# Altium schematic sheet Serial.SchDoc: Serial
size A3; Author: Orhun DABAK; DrawnBy: Orhun DABAK; Revision: 1.0; SheetNumber: 3; SheetTotal: 3
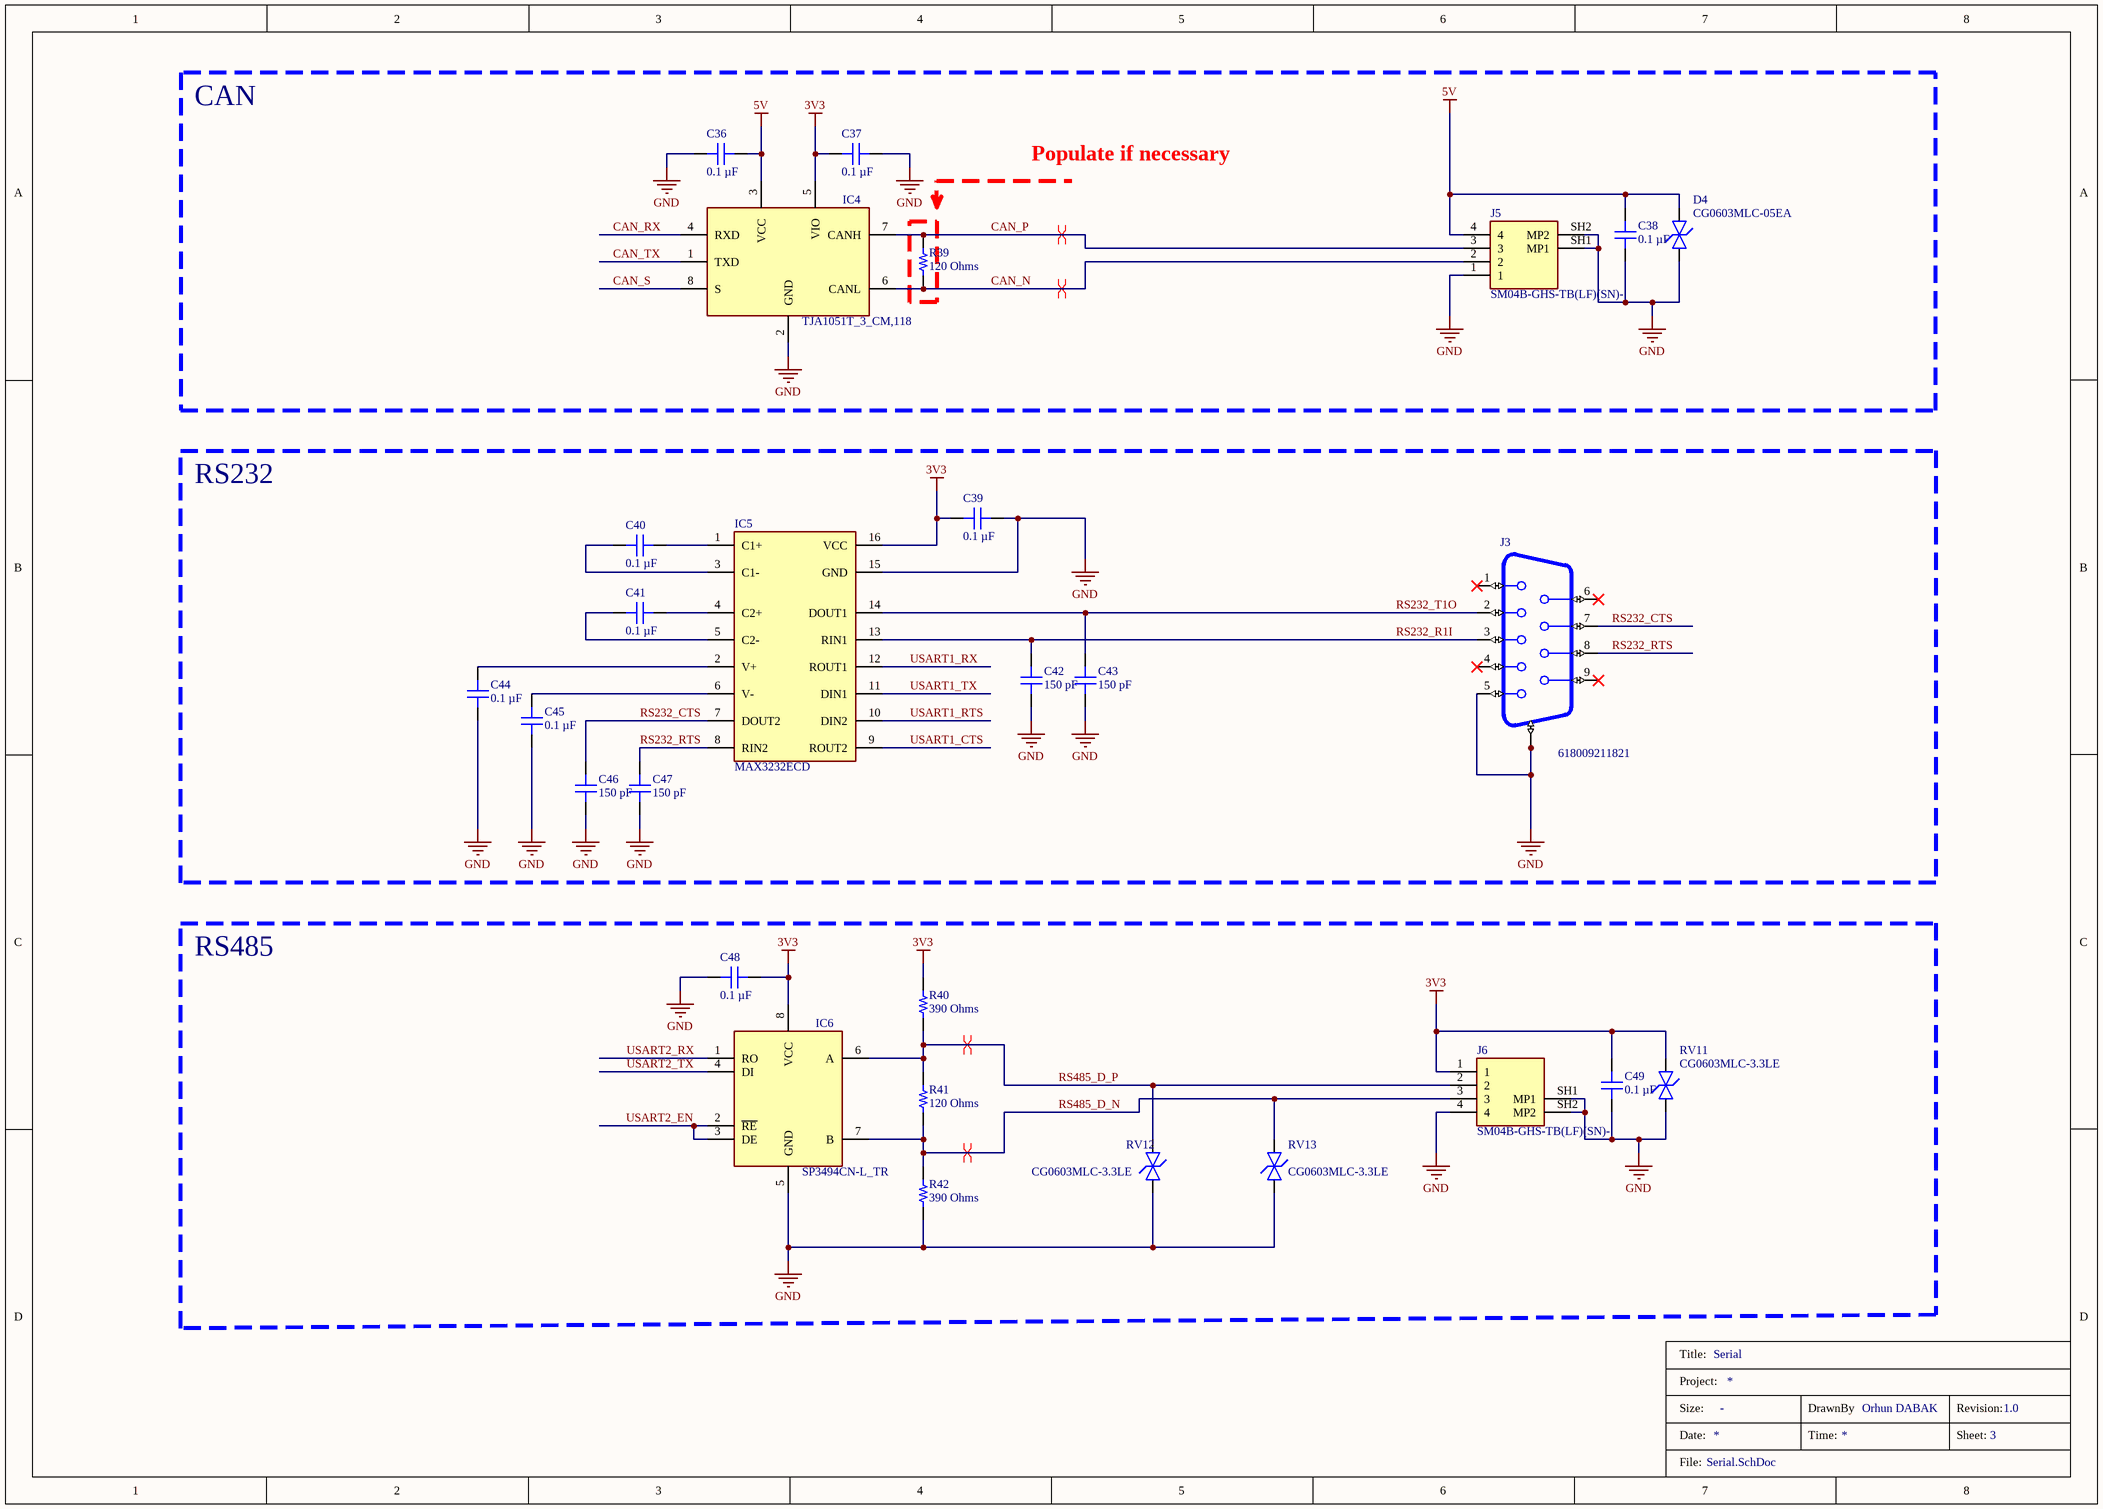
[diagram p0: Serial.SchDoc]

## Parts
*  Title_Block  (value not drawn)  (graphical)
C36  0.1 µF  [CAP 0603_1608]
C37  0.1 µF  [CAP 0603_1608]
C38  0.1 µF  [CAP 0603_1608]
C39  0.1 µF  [CAP 0603_1608]
C40  0.1 µF  [CAP 0603_1608]
C41  0.1 µF  [CAP 0603_1608]
C42  150 pF  [CAP 0603_1608]
C43  150 pF  [CAP 0603_1608]
C44  0.1 µF  [CAP 0603_1608]
C45  0.1 µF  [CAP 0603_1608]
C46  150 pF  [CAP 0603_1608]
C47  150 pF  [CAP 0603_1608]
C48  0.1 µF  [CAP 0603_1608]
C49  0.1 µF  [CAP 0603_1608]
D4  CG0603MLC-05EA  [DIONC1608X55N]
IC4  TJA1051T_3_CM,118  [SOIC127P600X175-8N]
IC5  MAX3232ECD  [SOIC127P600X175-16N]
IC6  SP3494CN-L_TR  [SOIC127P600X175-8N]
J3  618009211821  [618009211821]
J5  SM04B-GHS-TB(LF)(SN)-  [JST_SM04B-GHS-TB(LF)(SN)-]
J6  SM04B-GHS-TB(LF)(SN)-  [JST_SM04B-GHS-TB(LF)(SN)-]
R39  120 Ohms  [RES 0603_1608]
R40  390 Ohms  [RES 0603_1608]
R41  120 Ohms  [RES 0603_1608]
R42  390 Ohms  [RES 0603_1608]
RV11  CG0603MLC-3.3LE  [VARC1608X55N]
RV12  CG0603MLC-3.3LE  [VARC1608X55N]
RV13  CG0603MLC-3.3LE  [VARC1608X55N]

## Blocks framed on the sheet
CAN: C36-C38 D4 IC4 J5 R39
RS232: C39-C47 IC5 J3
RS485: C48 C49 IC6 J6 R40-R42 RV11-RV13

## Nets
3V3: C37.2 C39.2 C48.1 C49.2 IC4.5(VIO) IC5.16(VCC) IC6.8(VCC) J6.1 R40.2 RV11.2
5V: C36.1 C38.2 D4.2 IC4.3(VCC) J5.4
GND: C36.2 C37.1 C38.1 C39.1 C42.1 C43.1 C44.1 C45.1 C46.1 C47.1 C48.2 C49.1 D4.1 IC4.2(GND) IC5.15(GND) IC6.5(GND) J3.5 J3.Z1(SHIELD) J3.Z2(SHIELD) J5.1 J5.SH1(MP1) J5.SH2(MP2) J6.4 J6.SH1(MP1) J6.SH2(MP2) R42.1 RV11.1 RV12.1 RV13.1
CAN_N: IC4.6(CANL) J5.2 R39.1
CAN_P: IC4.7(CANH) J5.3 R39.2
CAN_RX: IC4.4(RXD)
CAN_S: IC4.8(S)
CAN_TX: IC4.1(TXD)
RS232_CTS: C46.2 IC5.7(DOUT2) J3.7
RS232_R1I: C42.2 IC5.13(RIN1) J3.3
RS232_RTS: C47.2 IC5.8(RIN2) J3.8
RS232_T1O: C43.2 IC5.14(DOUT1) J3.2
RS485_D_N: IC6.7(B) J6.3 R41.1 R42.2 RV13.2
RS485_D_P: IC6.6(A) J6.2 R40.1 R41.2 RV12.2
USART1_CTS: IC5.9(ROUT2)
USART1_RTS: IC5.10(DIN2)
USART1_RX: IC5.12(ROUT1)
USART1_TX: IC5.11(DIN1)
USART2_EN: IC6.2(~{RE}) IC6.3(DE)
USART2_RX: IC6.1(RO)
USART2_TX: IC6.4(DI)
NetC40_1: C40.1 IC5.1(C1+)
NetC40_2: C40.2 IC5.3(C1-)
NetC41_1: C41.1 IC5.4(C2+)
NetC41_2: C41.2 IC5.5(C2-)
NetC44_2: C44.2 IC5.2(V+)
NetC45_2: C45.2 IC5.6(V-)

Not connected (* = marked no-connect by the designer): J3 1* 4* 6* 9*

## Layout directives
differential pair: CAN_N, CAN_P, RS485_D_N, RS485_D_P

## Notes on the sheet
- Populate if necessary
- (in symbol Title_Block) Title:; Project:; Size:; DrawnBy; Revision:; Date:; Time:; Sheet:; File:

## Library data of the parts
* = Title_Block: Standart Title Block; Size: -
C36-C41 C44 C45 C48 C49 = CS0603KRX7R7BB104: CAP CER 0.1UF 16V X7R 0603; manufacturer: Yageo; Tolerance: ±10%; Part Number: CS0603KRX7R7BB104; Value: 0.1 µF; Applications: Boardflex Sensitive; Capacitance: 0.1 µF; componentlink1description: Datasheet; componentlink1url: http://www.yageo.com/NewPortal/yageodocoutput?fileName=/pdf/MLCC/UPY-ST_NPOX7R_16V-to-3KV_5.pdf; componentlink2description: DigiKey Link; componentlink2url: https://www.digikey.com/en/products/detail/yageo/CS0603KRX7R7BB104/6097897; Device Package: 0603 (1608 Metric); Features: Soft Termination; lastupdated: 3/3/2023 08:08:52 PM; Lifecycle Status: Active; Minimum Order: 1; Mounting Type: Surface Mount, MLCC; Operating Temperature: -55°C ~ 125°C; Package / Case: 0603 (1608 Metric); packaging: TapeAndReel; partid: 2286; Part Status: Active; price: 0.01; series: CS; Size / Dimension: 0.063" L x 0.031" W (1.60mm x 0.80mm); Supplier 1: DigiKey; Supplier Part Number 1: 311-3560-1-ND; Temperature Coefficient: X7R; Thickness (Max): 0.037" (0.95mm); Voltage - Rated: 16V
C42 C43 C46 C47 = 885012206029: CAP CER 150PF 16V X7R 0603; manufacturer: Würth Elektronik; Tolerance: ±10%; Part Number: 885012206029; Value: 150 pF; Applications: General Purpose; Capacitance: 150 pF; componentlink1description: Datasheet; componentlink1url: https://katalog.we-online.de/pbs/datasheet/885012206029.pdf; componentlink2description: DigiKey Link; componentlink2url: https://www.digikey.com/en/products/detail/würth-elektronik/885012206029/5453803; Device Package: 0603 (1608 Metric); lastupdated: 3/3/2023 08:08:49 PM; Lifecycle Status: Active; Minimum Order: 1; Mounting Type: Surface Mount, MLCC; Operating Temperature: -55°C ~ 125°C; Package / Case: 0603 (1608 Metric); packaging: TapeAndReel; partid: 3529; Part Status: Active; price: 0.02; series: WCAP-CSGP; Size / Dimension: 0.063" L x 0.031" W (1.60mm x 0.80mm); Supplier 1: DigiKey; Supplier Part Number 1: 732-7948-1-ND; Temperature Coefficient: X7R; Thickness (Max): 0.034" (0.87mm); Voltage - Rated: 16V
D4 = CG0603MLC-05EA: TVS Diode (Bi-directional); Manufacturer_Name: Bourns; Datasheet Link: https://datasheet.datasheetarchive.com/originals/dk/DKDS-12/224862.pdf; Height: 0.55mm; Manufacturer_Part_Number: CG0603MLC-05EA
IC4 = TJA1051T_3_CM,118: Integrated Circuit; Manufacturer_Name: NXP; Manufacturer_Part_Number: TJA1051T/3/CM,118; Datasheet Link: http://www.nxp.com/docs/en/data-sheet/TJA1051.pdf; Height: 1.75mm; Mouser Part Number: 771-TJA1051T/3CM118; Mouser Price/Stock: https://www.mouser.co.uk/ProductDetail/NXP-Semiconductors/TJA1051T-3-CM118?qs=5XOdhvmYM0NUkmo%252BpXvJfw%3D%3D; Arrow Part Number: TJA1051T/3/CM,118; Arrow Price/Stock: https://www.arrow.com/en/products/tja1051t3cm118/nxp-semiconductors?region=nac
IC5 = MAX3232ECD: Integrated Circuit; Manufacturer_Name: Texas Instruments; Datasheet Link: http://www.ti.com/lit/gpn/max3232e; Height: 1.75mm; Manufacturer_Part_Number: MAX3232ECD; Mouser Part Number: 595-MAX3232ECD; Mouser Price/Stock: https://www.mouser.co.uk/ProductDetail/Texas-Instruments/MAX3232ECD?qs=paYhMW8qfisAgX9h7jy%2FVw%3D%3D; Arrow Part Number: MAX3232ECD; Arrow Price/Stock: https://www.arrow.com/en/products/max3232ecd/texas-instruments?region=nac
IC6 = SP3494CN-L_TR: Integrated Circuit; Manufacturer_Name: MaxLinear; Manufacturer_Part_Number: SP3494CN-L/TR; Datasheet Link: https://www.arrow.com/en/products/sp3494cn-ltr/maxlinear-inc?region=nac; Height: 1.75mm; Mouser Part Number: 701-SP3494CN-L/TR; Mouser Price/Stock: https://www.mouser.co.uk/ProductDetail/MaxLinear/SP3494CN-L-TR?qs=3EMgrMjM0faUFCPV%252BPTaUQ%3D%3D; Arrow Part Number: SP3494CN-L/TR; Arrow Price/Stock: https://www.arrow.com/en/products/sp3494cn-ltr/maxlinear-inc?region=nac
J3 = 618009211821: 9 Position D-Sub Receptacle, Female Sockets Connector; MF: WÃ¼rth Elektronik; Value: *; Availability: In Stock; SnapEDA_Link: https://www.snapeda.com/parts/618009211821/Wurth+Elektronik/view-part/?ref=snap; Check_prices: https://www.snapeda.com/parts/618009211821/Wurth+Elektronik/view-part/?ref=eda; Package: None; Purchase-URL: https://pricing.snapeda.com/search/part/618009211821/?ref=eda; MP: 618009211821; Price: None
J5 J6 = SM04B-GHS-TB(LF)(SN)-: Connector Header Surface Mount, Right Angle 4 position 0.049 _1.25mm_; MP: SM04B-GHS-TB_LF__SN_-; MF: JST Sales; Availability: Unavailable; Package: None; Value: *; Price: None; SnapEDA_Link: https://www.snapeda.com/parts/SM04B-GHS-TB%28LF%29%28SN%29-/JST%20Sales%20America%20Inc./view-part/2759740/?ref=snap
R39 R41 = CRCW0603120RJNEA: RES SMD 120 OHM 5% 1/10W 0603; Manufacturer: Vishay Dale; Power (Watts): 0.1W, 1/10W; Temperature Coefficient: ±200ppm/°C; Part Number: CRCW0603120RJNEA; Value: 120 Ohms; ComponentLink1Description: Datasheet; ComponentLink1URL: http://www.vishay.com/docs/20035/dcrcwe3.pdf; ComponentLink2Description: DigiKey Link; ComponentLink2URL: https://www.digikey.com/en/products/detail/vishay-dale/CRCW0603120RJNEA/1174207; Composition: Thick Film; Device Package: 0603 (1608 Metric); Features: Automotive AEC-Q200; Height - Seated (Max): 0.020" (0.50mm); LastUpdated: 3/3/2023 08:29:48 PM; Lifecycle Status: Active; Minimum Order: 1; Number of Terminations: 2; Operating Temperature: -55°C ~ 155°C; Package / Case: 0603 (1608 Metric); Packaging: CutTape; PartId: 5196; Part Status: Active; Price: 0.01; Ratings: AEC-Q200; Resistance: 120 Ohms; Series: CRCW; Size / Dimension: 0.063" L x 0.033" W (1.60mm x 0.85mm); Supplier 1: DigiKey; Supplier Part Number 1: 541-120GCT-ND; Supplier Device Package: 0603; Tolerance: ±5%
R40 R42 = CRGP0603F390R: RES 390 OHM 1% 1/4W 0603; Manufacturer: TE Connectivity Passive Product; Power (Watts): 0.25W, 1/4W; Temperature Coefficient: ±100ppm/°C; Part Number: CRGP0603F390R; Value: 390 Ohms; ComponentLink1Description: Datasheet; ComponentLink1URL: https://www.te.com/commerce/DocumentDelivery/DDEController?Action=srchrtrv&DocNm=9-1773463-9&DocType=DS&DocLang=English; ComponentLink2Description: DigiKey Link; ComponentLink2URL: https://www.digikey.com/en/products/detail/te-connectivity-passive-product/CRGP0603F390R/8577013; Composition: Thick Film; Device Package: 0603 (1608 Metric); Features: Pulse Withstanding; Height - Seated (Max): 0.022" (0.55mm); LastUpdated: 3/3/2023 08:29:49 PM; Lifecycle Status: Active; Minimum Order: 1; Number of Terminations: 2; Operating Temperature: -55°C ~ 155°C; Package / Case: 0603 (1608 Metric); Packaging: TapeAndReel; PartId: 5035; Part Status: Active; Price: 0.02; Resistance: 390 Ohms; Series: CRGP; Size / Dimension: 0.063" L x 0.031" W (1.60mm x 0.80mm); Supplier 1: DigiKey; Supplier Part Number 1: A130411CT-ND; Supplier Device Package: 0603; Tolerance: ±1%
RV11-RV13 = CG0603MLC-3.3LE: Varistor; Manufacturer_Name: Bourns; Datasheet Link: https://www.bourns.com/docs/Product-Datasheets/MLC.pdf; Height: 0.55mm; Manufacturer_Part_Number: CG0603MLC-3.3LE; Mouser Part Number: 652-CG0603MLC-3.3LE; Mouser Price/Stock: https://www.mouser.co.uk/ProductDetail/Bourns/CG0603MLC-3.3LE?qs=m8myXnDJXpXlL5%252BDNWWe1g%3D%3D; Arrow Part Number: CG0603MLC-3.3LE; Arrow Price/Stock: https://www.arrow.com/en/products/cg0603mlc-3.3le/bourns?region=nac